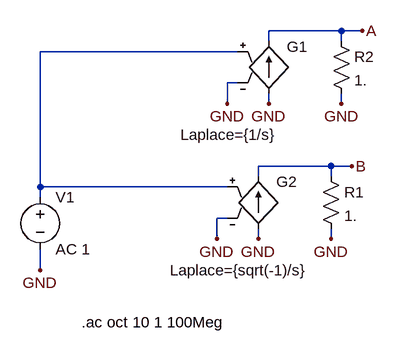
[diagram p0: schematic cplx.asc]
cplx.asc, the LTspice schematic file:
Version 4
SHEET 1 1540 912
WIRE 896 592 1184 592
WIRE 896 608 896 592
WIRE 896 688 896 720
WIRE 1232 672 1232 656
WIRE 1344 672 1344 656
WIRE 1232 576 1232 560
WIRE 1232 560 1344 560
WIRE 1344 560 1344 576
WIRE 1184 640 1168 640
WIRE 1168 640 1168 672
WIRE 1344 560 1376 560
WIRE 1248 464 1248 448
WIRE 1360 464 1360 448
WIRE 1248 368 1248 352
WIRE 1248 352 1360 352
WIRE 1360 352 1360 368
WIRE 1200 432 1184 432
WIRE 1184 432 1184 464
WIRE 1360 352 1392 352
WIRE 1200 384 896 384
WIRE 896 384 896 592
FLAG 896 720 GND
FLAG 1344 672 GND
FLAG 1232 672 GND
FLAG 1168 672 GND
FLAG 1376 560 B
FLAG 1360 464 GND
FLAG 1248 464 GND
FLAG 1184 464 GND
FLAG 1392 352 A
SYMBOL voltage 896 592 R0
SYMATTR InstName V1
SYMATTR Value AC 1
SYMBOL g 1232 560 R0
WINDOW 0 28 24 Left 0
WINDOW 3 -136 160 Left 0
SYMATTR InstName G2
SYMATTR Value Laplace={sqrt(-1)/s}
SYMBOL res 1328 560 R0
SYMATTR InstName R1
SYMATTR Value 1.
SYMBOL g 1248 352 R0
WINDOW 0 28 24 Left 0
WINDOW 3 -136 160 Left 0
SYMATTR InstName G1
SYMATTR Value Laplace={1/s}
SYMBOL res 1344 352 R0
SYMATTR InstName R2
SYMATTR Value 1.
TEXT 960 800 Left 0 !.ac oct 10 1 100Meg

The netlist it stands for:
* cplx.asc
V1 N001 GND AC 1
G2 GND B N001 GND Laplace={sqrt(-1)/s}
R1 B GND 1.
G1 GND A N001 GND Laplace={1/s}
R2 A GND 1.
.ac oct 10 1 100Meg
.backanno
.end